# EasyEDA Pro project ProProject_MiSTeR SNAC Sega Saturn_2024-05-17.epro

# Schematic sega_saturn
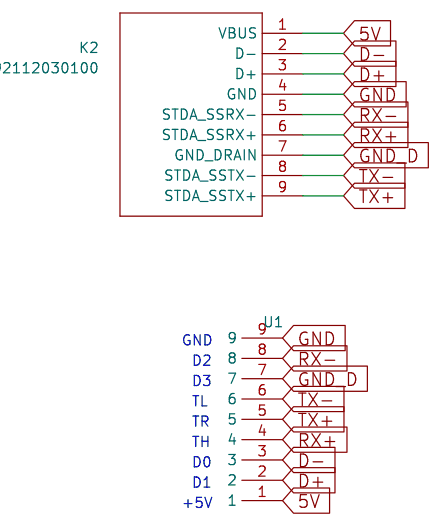
[diagram p0: schematic sheet]

## Parts
K2  692112030100  [692112030100]
U1  -  [SATURN CONNECTOR]

## Library data of the parts
K2 = Wuerth_Elektronik_eiCan_Communication_Connectors_STENCIL_692112030100_
U1 = saturn_connector

## Nets
5V: K2.1(VBUS) U1.1
GND: K2.4(GND) U1.9
GND_D: K2.7(GND_DRAIN) U1.7
D+: K2.3(D+) U1.2
D-: K2.2(D-) U1.3
RX+: K2.6(STDA_SSRX+) U1.4
RX-: K2.5(STDA_SSRX-) U1.8
TX+: K2.9(STDA_SSTX+) U1.5
TX-: K2.8(STDA_SSTX-) U1.6

## Notes on the sheet
- GND
- D2
- D3
- TL
- TR
- TH
- D0
- D1
- +5V

# Board sega_saturn
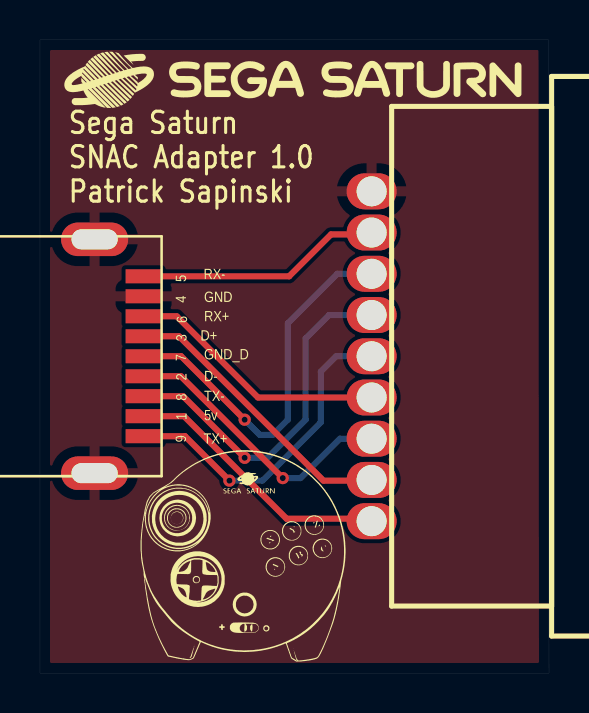
[diagram p1: board, top side]
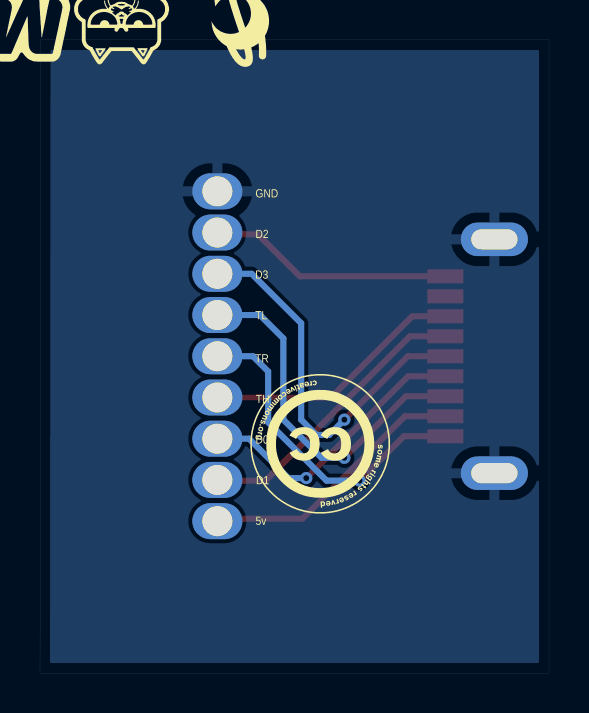
[diagram p2: board, bottom side, seen from below]

Outline 25.46 x 31.67 mm; copper layers: Top Layer, Bottom Layer. Coordinates in mm from the lower left corner of the outline.
Outline path: 0,31.67 0,0 25.46,0 25.43,31.67 0,31.67
Stack: Top Layer 0.035mm / Dielectric1 1.51mm FR4 er 4.5 / Bottom Layer 0.035mm

## Design rules (mm)
template: Custom Config
spacing copperThickness1oz (default): track to track 0.102, other pairs 0.152 to 0.3
spacing copperThickness2oz: track to track 0.203, other pairs 0.152 to 0.3
track width copperThickness1oz (default): min 0.127, default 0.254, max 2.54
track width copperThickness2oz: min 0.203, default 0.254, max 2.54
differential pair differentialPair (default): width min 0.127, default 0.254, max 2.54; gap min 0.152, default 0.152
via viaSize (default): diameter min 0.5, default 0.61, max 10; hole min 0.3, default 0.305, max 6.299

## Placement (name value [footprint] x y rotation side)
K2  -  [692112030100]  5.18 15.85 90 top
U1  -  [SATURN CONNECTOR]  16.59 15.85 270 top

## Footprints (pads in the part's own frame, mm; a bottom-side part is the same pattern mirrored in y, then rotated)
692112030100
  rect 0.7x1.8 smd: 1(-3,0) 2(-1,0) 3(1,0) 4(3,0) 5(4,0) 6(2,0) 7(0,0) 8(-2,0) 9(-4,0)
  oval 1.677x3.353 hole 1x2.312: Z1(5.85,2.45) Z2(-5.85,2.45)
SATURN CONNECTOR
  oval 1.8x2.5 hole 1.5: 1(8.252,0) 2(6.189,0) 3(4.126,0) 4(2.063,0) 5(0,0) 6(-2.063,0) 7(-4.126,0) 8(-6.189,0) 9(-8.252,0)

## Nets
As in the schematic, except:
GND: K2.4 K2.Z1 K2.Z2 U1.9

## Via types
v1: diameter 0.61, hole 0.305, Top Layer to Bottom Layer, 4 vias

## Routing (per net, layer and track width the routed paths; a pad name or vN(x,y) marks a point on that pad's centre or on a via; arc(x,y) is an arc through that point)
5V: length 13.6
  Top Layer w0.305: U1.1 16.46,7.72 12.33,7.72 7.2,12.85 K2.1
GND_D: length 19.2
  Top Layer w0.305: v1(10.24,12.67) 7.06,15.85 K2.7
  Bottom Layer w0.305: U1.7 14.87,19.98 12.39,17.5 12.39,12.67 11.63,11.91 11,11.91 v1(10.24,12.67)
D+: length 14.4
  Top Layer w0.305: K2.3 6.95,16.85 14.17,9.63 16.55,9.63 U1.2
D-: length 14.3
  Top Layer w0.305: K2.2 7.04,14.85 v1(12.14,9.75)
  Bottom Layer w0.305: v1(12.14,9.75) 13.03,9.75 15,11.72 U1.3
RX+: length 13.1
  Top Layer w0.305: K2.6 6.84,17.85 10.9,13.79 U1.4
RX-: length 12.3
  Top Layer w0.305: K2.5 12.46,19.85 14.55,21.95 16.49,21.95 16.59,22.04
TX+: length 16.4
  Top Layer w0.305: v1(9.47,9.63) 7.25,11.85 K2.9
  Bottom Layer w0.305: U1.5 14.81,15.85 14.05,15.09 14.05,12.55 11.12,9.63 v1(9.47,9.63)
TX-: length 18
  Top Layer w0.305: K2.8 7.16,13.85 v1(10.24,10.77)
  Bottom Layer w0.305: v1(10.24,10.77) 11.38,10.77 13.28,12.67 13.28,16.74 14.46,17.91 U1.6

## Copper pours and planes (outline as drawn; the poured copper is in the pictures)
GND on Top Layer: 0.32,31.22 25.08,31.22 25.08,0.36 0.32,0.36
GND on Bottom Layer: 0.33,31.34 25.09,31.34 25.09,0.36 0.33,0.36

## Text on the board
Bottom Silkscreen Layer: D1 | TH | 5v | D0 | GND | D2 | TL | D3 | TR
Top Silkscreen Layer: Sega Saturn / SNAC Adapter 1.0 / Patrick Sapinski | D+ | RX- | TX+ | GND | RX+ | GND_D | D- | TX- | 5v | 5 | 4 | 7 | 9 | 3 | 2 | 8 | 1 | 6
